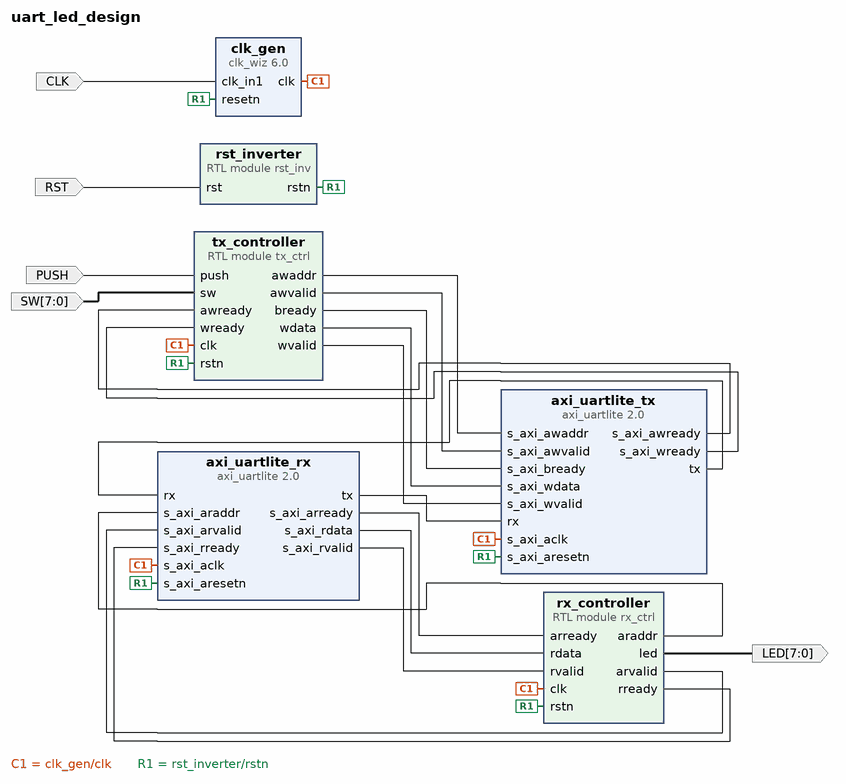
[diagram p0: block diagram of the top level]
# Vivado block design uart_led_design, xc7a100tcsg324-1, Vivado 2023.1.1
create_bd_design uart_led_design

create_bd_port -dir I -type clk CLK
set_property -dict {CONFIG.FREQ_HZ 100000000} [get_bd_ports CLK]
create_bd_port -dir I -type rst RST
set_property -dict {CONFIG.POLARITY ACTIVE_HIGH} [get_bd_ports RST]
create_bd_port -dir I PUSH
create_bd_port -dir I -from 7 -to 0 -type data SW
create_bd_port -dir O -from 7 -to 0 -type data LED

create_bd_cell -type ip -vlnv xilinx.com:ip:axi_uartlite:2.0 axi_uartlite_rx
set_property -dict {CONFIG.C_BAUDRATE 115200} [get_bd_cells axi_uartlite_rx]
create_bd_cell -type ip -vlnv xilinx.com:ip:axi_uartlite:2.0 axi_uartlite_tx
set_property -dict {CONFIG.C_BAUDRATE 115200} [get_bd_cells axi_uartlite_tx]
create_bd_cell -type module -reference tx_ctrl tx_controller
create_bd_cell -type module -reference rx_ctrl rx_controller
create_bd_cell -type module -reference rst_inv rst_inverter
create_bd_cell -type ip -vlnv xilinx.com:ip:clk_wiz:6.0 clk_gen
set_property -dict [list \
  CONFIG.CLKOUT1_DRIVES BUFGCE \
  CONFIG.CLKOUT1_JITTER 116.394 \
  CONFIG.CLKOUT1_PHASE_ERROR 87.466 \
  CONFIG.CLKOUT2_DRIVES BUFGCE \
  CONFIG.CLKOUT3_DRIVES BUFGCE \
  CONFIG.CLKOUT4_DRIVES BUFGCE \
  CONFIG.CLKOUT5_DRIVES BUFGCE \
  CONFIG.CLKOUT6_DRIVES BUFGCE \
  CONFIG.CLKOUT7_DRIVES BUFGCE \
  CONFIG.CLK_OUT1_PORT clk \
  CONFIG.FEEDBACK_SOURCE FDBK_AUTO \
  CONFIG.JITTER_SEL Min_O_Jitter \
  CONFIG.MMCM_BANDWIDTH HIGH \
  CONFIG.MMCM_CLKFBOUT_MULT_F 11.875 \
  CONFIG.MMCM_CLKOUT0_DIVIDE_F 11.875 \
  CONFIG.RESET_PORT resetn \
  CONFIG.RESET_TYPE ACTIVE_LOW \
  CONFIG.USE_LOCKED false \
  CONFIG.USE_SAFE_CLOCK_STARTUP true \
] [get_bd_cells clk_gen]

# ---- connections ----

connect_bd_net [get_bd_ports CLK] [get_bd_pins clk_gen/clk_in1]
connect_bd_net [get_bd_ports PUSH] [get_bd_pins tx_controller/push]
connect_bd_net [get_bd_ports RST] [get_bd_pins rst_inverter/rst]
connect_bd_net [get_bd_ports SW] [get_bd_pins tx_controller/sw]
connect_bd_net -net axi_uartlite_0_tx [get_bd_pins axi_uartlite_rx/tx] [get_bd_pins axi_uartlite_tx/rx]
connect_bd_net -net axi_uartlite_1_tx [get_bd_pins axi_uartlite_tx/tx] [get_bd_pins axi_uartlite_rx/rx]
connect_bd_net [get_bd_pins axi_uartlite_rx/s_axi_arready] [get_bd_pins rx_controller/arready]
connect_bd_net [get_bd_pins axi_uartlite_rx/s_axi_rdata] [get_bd_pins rx_controller/rdata]
connect_bd_net [get_bd_pins axi_uartlite_rx/s_axi_rvalid] [get_bd_pins rx_controller/rvalid]
connect_bd_net [get_bd_pins axi_uartlite_tx/s_axi_awready] [get_bd_pins tx_controller/awready]
connect_bd_net [get_bd_pins axi_uartlite_tx/s_axi_wready] [get_bd_pins tx_controller/wready]
connect_bd_net -net clk_wiz_0_clk [get_bd_pins clk_gen/clk] \
  [get_bd_pins tx_controller/clk] [get_bd_pins axi_uartlite_tx/s_axi_aclk] [get_bd_pins axi_uartlite_rx/s_axi_aclk] \
  [get_bd_pins rx_controller/clk]
connect_bd_net [get_bd_pins rst_inverter/rstn] \
  [get_bd_pins tx_controller/rstn] [get_bd_pins axi_uartlite_tx/s_axi_aresetn] [get_bd_pins axi_uartlite_rx/s_axi_aresetn] \
  [get_bd_pins rx_controller/rstn] [get_bd_pins clk_gen/resetn]
connect_bd_net [get_bd_pins rx_controller/araddr] [get_bd_pins axi_uartlite_rx/s_axi_araddr]
connect_bd_net [get_bd_pins rx_controller/arvalid] [get_bd_pins axi_uartlite_rx/s_axi_arvalid]
connect_bd_net [get_bd_pins rx_controller/led] [get_bd_ports LED]
connect_bd_net [get_bd_pins rx_controller/rready] [get_bd_pins axi_uartlite_rx/s_axi_rready]
connect_bd_net [get_bd_pins tx_controller/awaddr] [get_bd_pins axi_uartlite_tx/s_axi_awaddr]
connect_bd_net [get_bd_pins tx_controller/awvalid] [get_bd_pins axi_uartlite_tx/s_axi_awvalid]
connect_bd_net [get_bd_pins tx_controller/bready] [get_bd_pins axi_uartlite_tx/s_axi_bready]
connect_bd_net [get_bd_pins tx_controller/wdata] [get_bd_pins axi_uartlite_tx/s_axi_wdata]
connect_bd_net [get_bd_pins tx_controller/wvalid] [get_bd_pins axi_uartlite_tx/s_axi_wvalid]

validate_bd_design
save_bd_design
